# Altium schematic sheet v1.2.SchDoc
size 55 x 50 mm
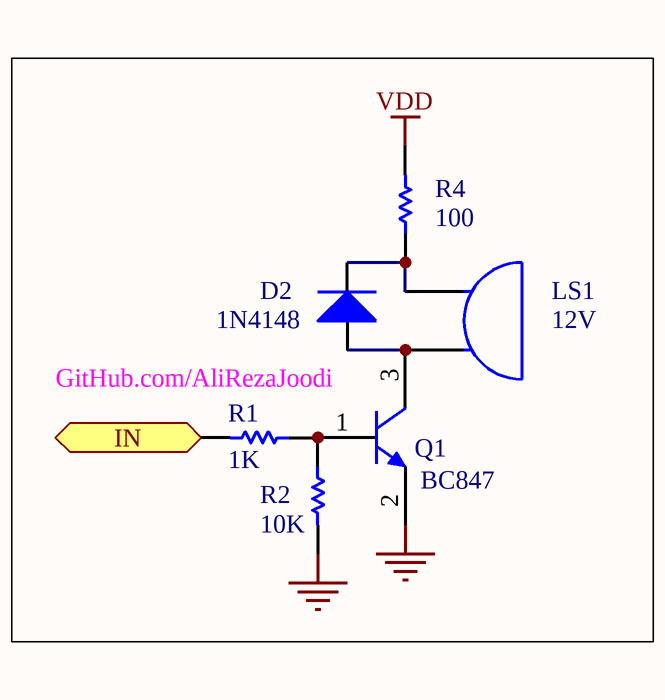
[diagram p0: v1.2.SchDoc]

## Parts
D2  value 1N4148  [SOD-523]  (hidden comment: Diode)
LS1  value 12V  [RB_7.62mm]  (hidden comment: Buzzer)
Q1  value BC847  [SOT23-3N]  (hidden comment: NPN)
R1  value 1K  [0805]  (hidden comment: Res1)
R2  value 10K  [0805]  (hidden comment: Res1)
R4  value 100  [0805]  (hidden comment: Res1)

## Ports
IN (in)

## Nets
GND: Q1.2(E) R2.2
VDD: R4.2
IN: R1.2 ; port IN
NetD2_1: D2.1(A) LS1.2(B) Q1.3(C)
NetD2_2: D2.2(K) LS1.1(A) R4.1
NetQ1_1: Q1.1(B) R1.1 R2.1

## Notes on the sheet
- GitHub.com/AliRezaJoodi

## Library data of the parts
D2 = Diode: Default Diode; Manufacturer: Generic Components; Class I: Discrete; Class II: Diode - Switching; Published: 8-Jun-2000; Revision: July-2002: Re-released for DXP Platform.; Publisher: Altium Limited
LS1 = Buzzer: Sounder; Manufacturer: Generic Components; Published: 24-Mar-1999; Revision: July-2002: Re-released for DXP Platform.; Publisher: Altium Limited
Q1 = BC847: Silicon Bipolar Transistor
R1 R2 R4 = Res1: Resistor; Published: 8-Jun-2000; LatestRevisionDate: 17-Jul-2002; LatestRevisionNote: Re-released for DXP Platform.; PackageReference: AXIAL-0.3; Publisher: Altium Limited